# EAGLE design UV_exposure_led_v1.0 (EAGLE 7.2.0)
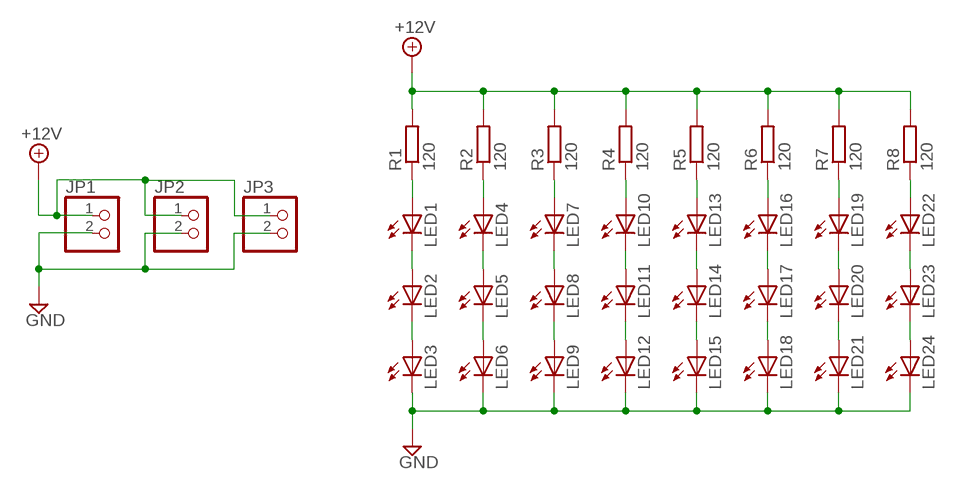
[diagram p0: schematic, sheet 1]

## Parts
JP1  PINHD-1X2  [1X02]
JP2  PINHD-1X2  [1X02]
JP3  PINHD-1X2  [1X02]
LED1  LED5MM  [LED5MM]
LED2  LED5MM  [LED5MM]
LED3  LED5MM  [LED5MM]
LED4  LED5MM  [LED5MM]
LED5  LED5MM  [LED5MM]
LED6  LED5MM  [LED5MM]
LED7  LED5MM  [LED5MM]
LED8  LED5MM  [LED5MM]
LED9  LED5MM  [LED5MM]
LED10  LED5MM  [LED5MM]
LED11  LED5MM  [LED5MM]
LED12  LED5MM  [LED5MM]
LED13  LED5MM  [LED5MM]
LED14  LED5MM  [LED5MM]
LED15  LED5MM  [LED5MM]
LED16  LED5MM  [LED5MM]
LED17  LED5MM  [LED5MM]
LED18  LED5MM  [LED5MM]
LED19  LED5MM  [LED5MM]
LED20  LED5MM  [LED5MM]
LED21  LED5MM  [LED5MM]
LED22  LED5MM  [LED5MM]
LED23  LED5MM  [LED5MM]
LED24  LED5MM  [LED5MM]
R1  120  R-EU_R1206W  [R1206W]
R2  120  R-EU_R1206W  [R1206W]
R3  120  R-EU_R1206W  [R1206W]
R4  120  R-EU_R1206W  [R1206W]
R5  120  R-EU_R1206W  [R1206W]
R6  120  R-EU_R1206W  [R1206W]
R7  120  R-EU_R1206W  [R1206W]
R8  120  R-EU_R1206W  [R1206W]

## Nets
+12V: JP1.1 JP2.1 JP3.1 R1.2 R2.2 R3.2 R4.2 R5.2 R6.2 R7.2 R8.2
GND: JP1.2 JP2.2 JP3.2 LED3.K(C) LED6.K(C) LED9.K(C) LED12.K(C) LED15.K(C) LED18.K(C) LED21.K(C) LED24.K(C)
N$1: LED2.K(C) LED3.A
N$2: LED1.K(C) LED2.A
N$6: LED1.A R1.1
N$9: LED5.K(C) LED6.A
N$10: LED4.K(C) LED5.A
N$11: LED4.A R2.1
N$12: LED8.K(C) LED9.A
N$13: LED7.K(C) LED8.A
N$14: LED7.A R3.1
N$15: LED11.K(C) LED12.A
N$16: LED10.K(C) LED11.A
N$17: LED10.A R4.1
N$18: LED14.K(C) LED15.A
N$19: LED13.K(C) LED14.A
N$20: LED13.A R5.1
N$21: LED17.K(C) LED18.A
N$22: LED16.K(C) LED17.A
N$23: LED16.A R6.1
N$24: LED20.K(C) LED21.A
N$25: LED19.K(C) LED20.A
N$26: LED19.A R7.1
N$27: LED23.K(C) LED24.A
N$28: LED22.K(C) LED23.A
N$29: LED22.A R8.1

## Library data of the parts
JP1-JP3 = pinhead:PINHD-1X2: PIN HEADER
LED1-LED24 = led:LED: LED OSRAM: - CHIPLED LG R971, LG N971, LY N971, LG Q971, LY Q971, LO R971, LY R971 LH N974, LH R974 LS Q976, LO Q976, LY Q976 LO Q996 - Hyper CHIPLED LW Q18S LB Q993, LB Q99A, LB R99A - SideLED LS A670, LO A670, LY A670, LG A670, LP A670 LB A673, LV A673, LT A673, LW A673 LH A674 LY A675 LS A676, LA A676, LO A676, LY A676, LW A676 LS A679, LY A679, LG A679 - Hyper Micro SIDELED® LS Y876, LA Y876, LO Y876, LY Y876 LT Y87S - SmartLED LW L88C, LW L88S LB L89C, LB L89S, LG L890 LS L89K, LO L89K, LY L89K LS L896, LA L896, LO L896, LY L896 - TOPLED LS T670, LO T670, LY T670, LG T670, LP T670 LSG T670, LSP T670, LSY T670, LOP T670, LYG T670 LG T671, LOG T671, LSG T671 LB T673, LV T673, LT T673, LW T673 LH T674 LS T676, LA T676, LO T676, LY T676, LB T676, LH T676, LSB T676, LW T676 LB T67C, LV T67C, LT T67C, LS T67K, LO T67K, LY T67K, LW E67C LS E67B, LA E67B, LO E67B, LY E67B, LB E67C, LV E67C, LT E67C LW T67C LS T679, LY T679, LG T679 LS T770, LO T770, LY T770, LG T770, LP T770 LB T773, LV T773, LT T773, LW T773 LH T774 LS E675, LA E675, LY E675, LS T675 LS T776, LA T776, LO T776, LY T776, LB T776 LHGB T686 LT T68C, LB T68C - Hyper Mini TOPLED® LB M676 - Mini TOPLED Santana® LG M470 LS M47K, LO M47K, LY M47K Source: http://www.osram.convergy.de LUXEON: - LUMILED® LXK2-PW12-R00, LXK2-PW12-S00, LXK2-PW14-U00, LXK2-PW14-V00 LXK2-PM12-R00, LXK2-PM12-S00, LXK2-PM14-U00 LXK2-PE12-Q00, LXK2-PE12-R00, LXK2-PE12-S00, LXK2-PE14-T00, LXK2-PE14-U00 LXK2-PB12-K00, LXK2-PB12-L00, LXK2-PB12-M00, LXK2-PB14-N00, LXK2-PB14-P00, LXK2-PB14-Q00 LXK2-PR12-L00, LXK2-PR12-M00, LXK2-PR14-Q00, LXK2-PR14-R00 LXK2-PD12-Q00, LXK2-PD12-R00, LXK2-PD12-S00 LXK2-PH12-R00, LXK2-PH12-S00 LXK2-PL12-P00, LXK2-PL12-Q00, LXK2-PL12-R00 Source: www.luxeon.com KINGBRIGHT: KA-3528ASYC Source: www.kingbright.com
R1-R8 = rcl:R-EU_: RESISTOR, European symbol

## Net classes
0 default: clearance 0.205 mm

## Board
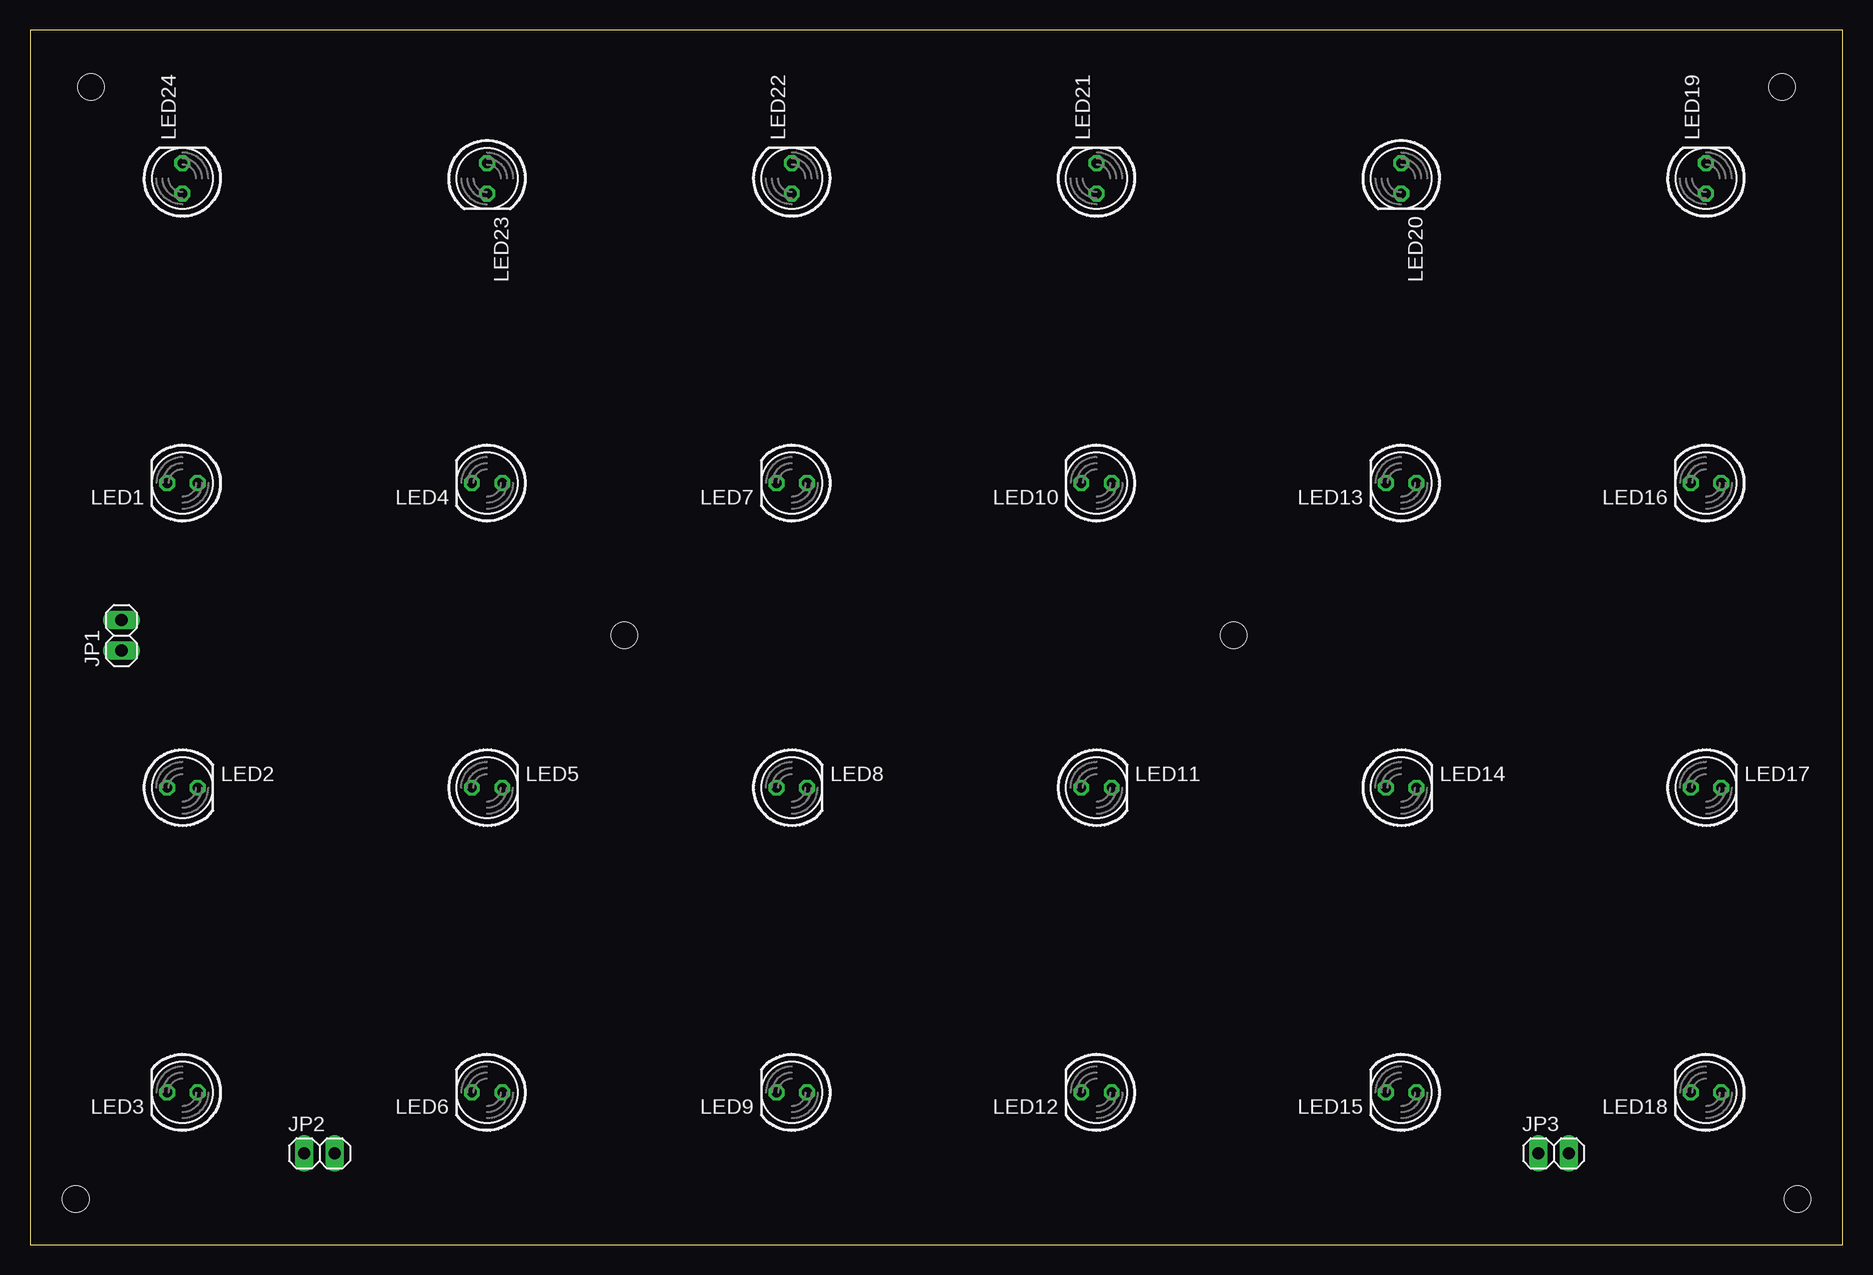
[diagram p1: board, top side]
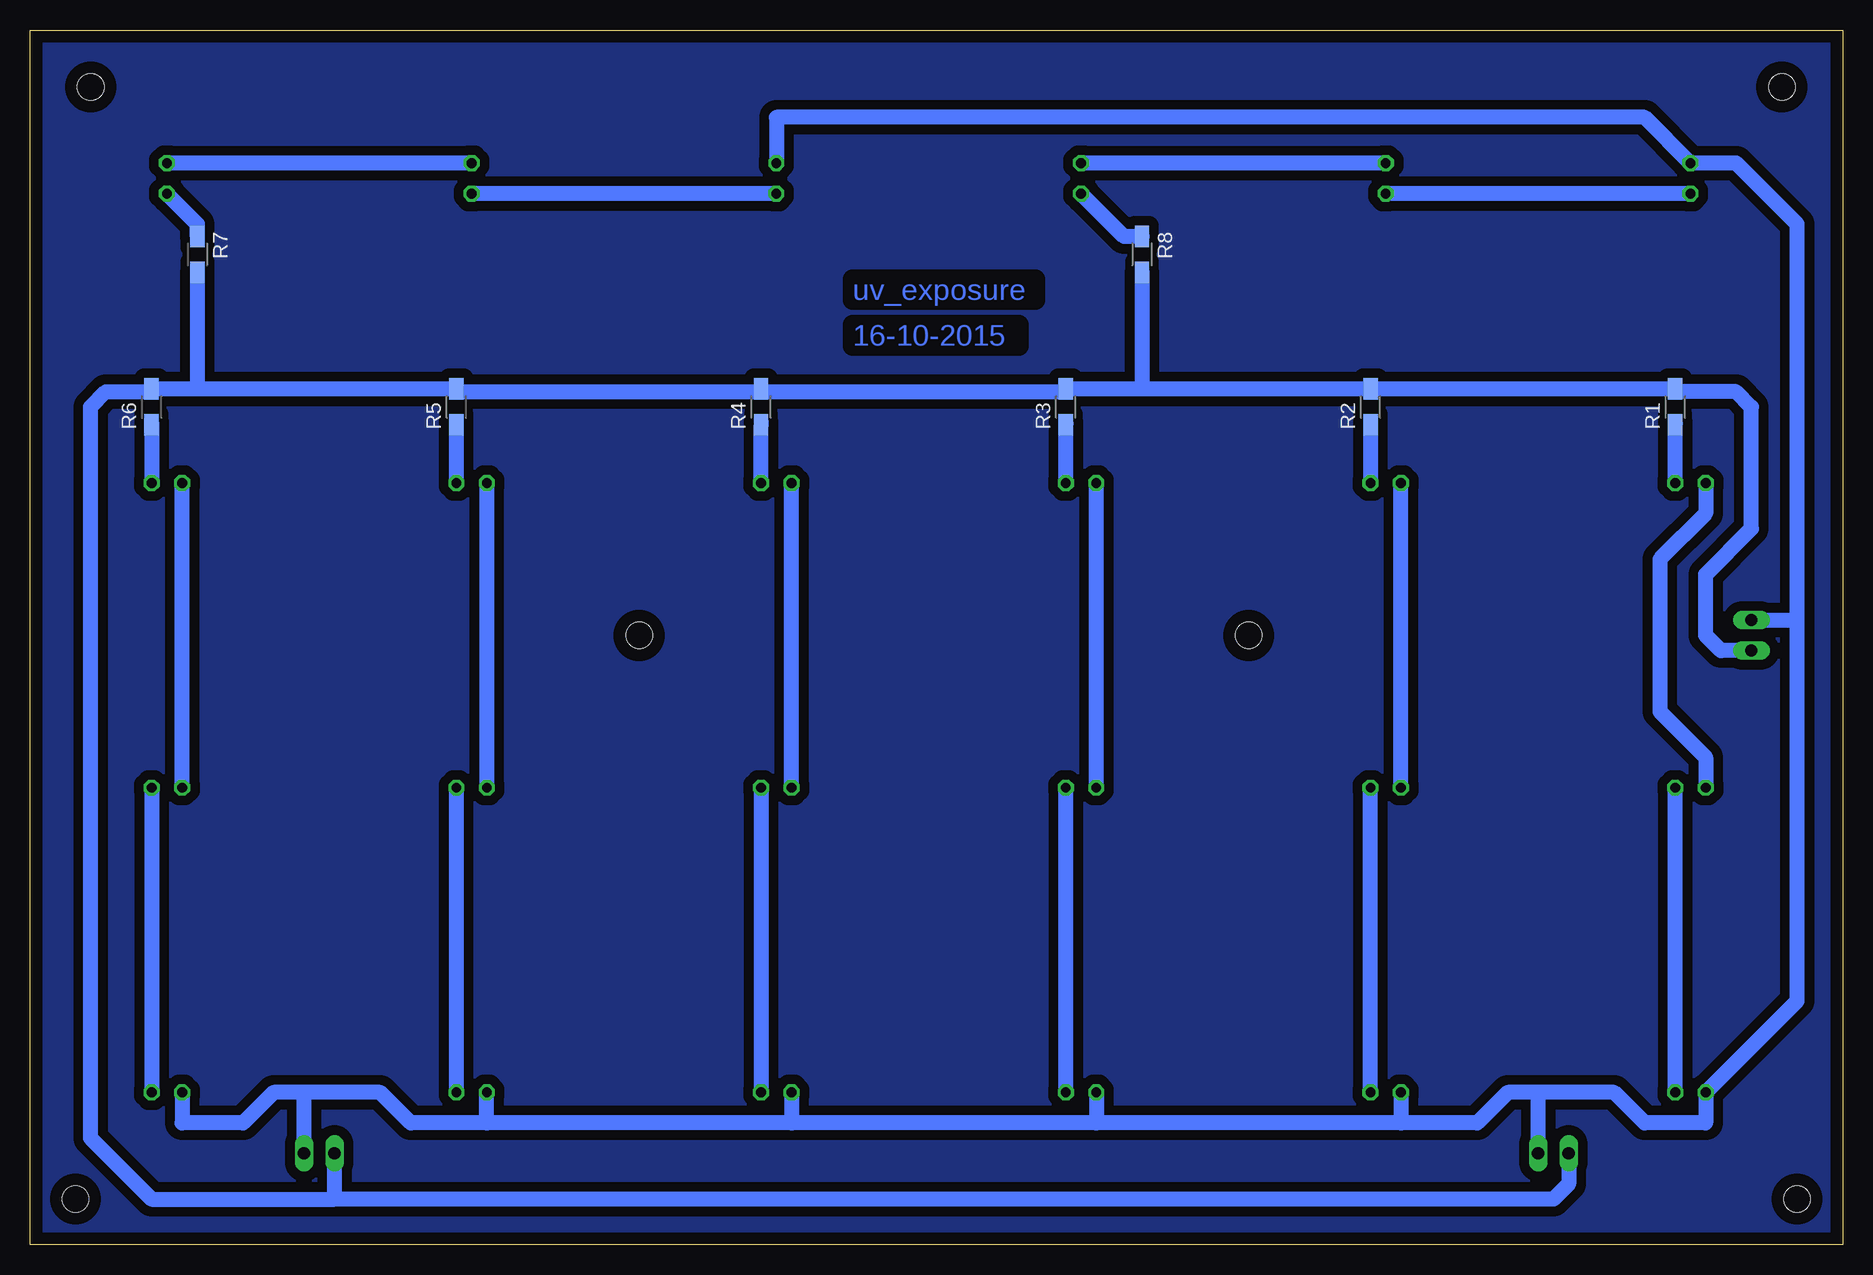
[diagram p2: board, bottom side, seen from below]

Size 151.11 x 101.27 mm. Coordinates in mm from the lower left corner, seen from the top.
Outline: 0,0 151.11,0 151.11,101.27 0,101.27 0,0
Copper layers (1*16): Top 0.035mm / dielectric 1.5mm / Bottom 0.035mm
Design rules "default *": minimum track width 10mil, minimum drill 24mil, track to track 8mil, track to pad 8mil, pad to pad 8mil, via to via 8mil, smd to smd 8mil, copper to edge 40mil, drill to drill 8mil, minimum pad ring 10mil, minimum via ring 8mil, stop-mask expansion 4mil, vias tented up to drill 0mil, thermal gap 10mil
Holes 2.2 mm at 5.08,96.52 146.05,96.52 147.32,3.81 3.81,3.81 49.53,50.8 100.33,50.8

### Footprints (pad centres in the part's own frame; a part is rotated, then mirrored left to right if it is on the bottom)
1X02 = drill 1.016 long: 1 -1.27,0; 2 1.27,0
LED5MM = drill 0.813 octagon: A -1.27,0; K 1.27,0
R1206W = smd 1.8 x 1.2: 1 -1.499,0; 2 1.499,0

### Placement (x,y rotation side)
JP1  7.62,50.8 90 top
JP2  24.13,7.62 0 top
JP3  127,7.62 0 top
LED1  12.7,63.5 180 top
LED2  12.7,38.1 0 top
LED3  12.7,12.7 180 top
LED4  38.1,63.5 180 top
LED5  38.1,38.1 0 top
LED6  38.1,12.7 180 top
LED7  63.5,63.5 180 top
LED8  63.5,38.1 0 top
LED9  63.5,12.7 180 top
LED10  88.9,63.5 180 top
LED11  88.9,38.1 0 top
LED12  88.9,12.7 180 top
LED13  114.3,63.5 180 top
LED14  114.3,38.1 0 top
LED15  114.3,12.7 180 top
LED16  139.7,63.5 180 top
LED17  139.7,38.1 0 top
LED18  139.7,12.7 180 top
LED19  139.7,88.9 90 top
LED20  114.3,88.9 270 top
LED21  88.9,88.9 90 top
LED22  63.5,88.9 90 top
LED23  38.1,88.9 270 top
LED24  12.7,88.9 90 top
R1  13.97,69.85 90 bottom
R2  39.37,69.85 90 bottom
R3  64.77,69.85 90 bottom
R4  90.17,69.85 90 bottom
R5  115.57,69.85 90 bottom
R6  140.97,69.85 90 bottom
R7  137.16,82.55 270 bottom
R8  58.42,82.55 270 bottom

### Tracks (layer width: path | path; a pad name or v marks a point on that pad's centre or on a via)
+12V
  Bottom 1.27: 90.17,71.12 115.57,71.12 R5.2 137.16,71.35 | 90.17,71.12 64.77,71.12 R3.2 58.42,71.35 | 90.17,71.12 R4.2 | 137.16,71.35 R6.2 141.2,71.12 144.78,71.12 146.05,69.85 146.05,8.89 140.97,3.81 125.73,3.81 | R7.2 137.16,71.35 | 58.42,71.35 R2.2 R1.2 13.74,71.12 8.89,71.12 7.62,69.85 7.62,59.69 11.43,55.88 11.43,50.8 10.16,49.53 JP1.1 | R8.2 58.42,71.35 | JP2.1 22.86,5.08 24.13,3.81 125.73,3.81 | 125.73,3.81 JP3.1
GND
  Bottom 1.27: LED21.K 88.9,93.98 16.51,93.98 LED24.K 8.89,90.17 3.81,85.09 3.81,52.07 | LED18.K 138.43,10.16 133.35,10.16 130.81,12.7 128.27,12.7 | 113.03,10.16 LED15.K | LED12.K 87.63,10.16 | 87.63,10.16 113.03,10.16 | LED9.K 62.23,10.16 | 62.23,10.16 87.63,10.16 | LED6.K 36.83,10.16 | 36.83,10.16 62.23,10.16 | JP1.2 3.81,52.07 | 3.81,52.07 3.81,20.32 LED3.K 11.43,10.16 16.51,10.16 19.05,12.7 25.4,12.7 | 36.83,10.16 30.48,10.16 27.94,12.7 25.4,12.7 | JP2.2 25.4,12.7 | 113.03,10.16 119.38,10.16 121.92,12.7 128.27,12.7 | JP3.2 128.27,12.7
N$1
  Bottom 1.27: LED3.A LED2.K
N$2
  Bottom 1.27: LED1.K 11.43,60.96 15.24,57.15 15.24,44.45 11.43,40.64 LED2.A
N$3
  pour Bottom (isolate 0.813): 0,0 151.13,0 151.13,101.6 0,101.6
N$6
  Bottom 1.27: LED1.A R1.1 13.97,68.58
N$9
  Bottom 1.27: LED6.A LED5.K
N$10
  Bottom 1.27: LED5.A LED4.K
N$11
  Bottom 1.27: LED4.A R2.1 39.37,68.58
N$12
  Bottom 1.27: LED9.A LED8.K
N$13
  Bottom 1.27: LED8.A LED7.K
N$14
  Bottom 1.27: 64.77,68.58 R3.1 LED7.A
N$15
  Bottom 1.27: LED11.K LED12.A
N$16
  Bottom 1.27: LED11.A LED10.K
N$17
  Bottom 1.27: LED10.A R4.1 90.17,68.58
N$18
  Bottom 1.27: LED14.K LED15.A
N$19
  Bottom 1.27: LED13.K LED14.A
N$20
  Bottom 1.27: LED13.A R5.1 115.57,68.58
N$21
  Bottom 1.27: LED17.K LED18.A
N$22
  Bottom 1.27: LED17.A LED16.K
N$23
  Bottom 1.27: LED16.A R6.1 140.97,68.58
N$24
  Bottom 1.27: LED21.A LED20.K
N$25
  Bottom 1.27: LED20.A LED19.K
N$26
  Bottom 1.27: R7.1 137.16,85.09 LED19.A
N$27
  Bottom 1.27: LED24.A LED23.K
N$28
  Bottom 1.27: LED23.A LED22.K
N$29
  Bottom 1.27: R8.1 59.92,84.05 LED22.A

### Text on the board
Bottom: uv_exposure | 16-10-2015